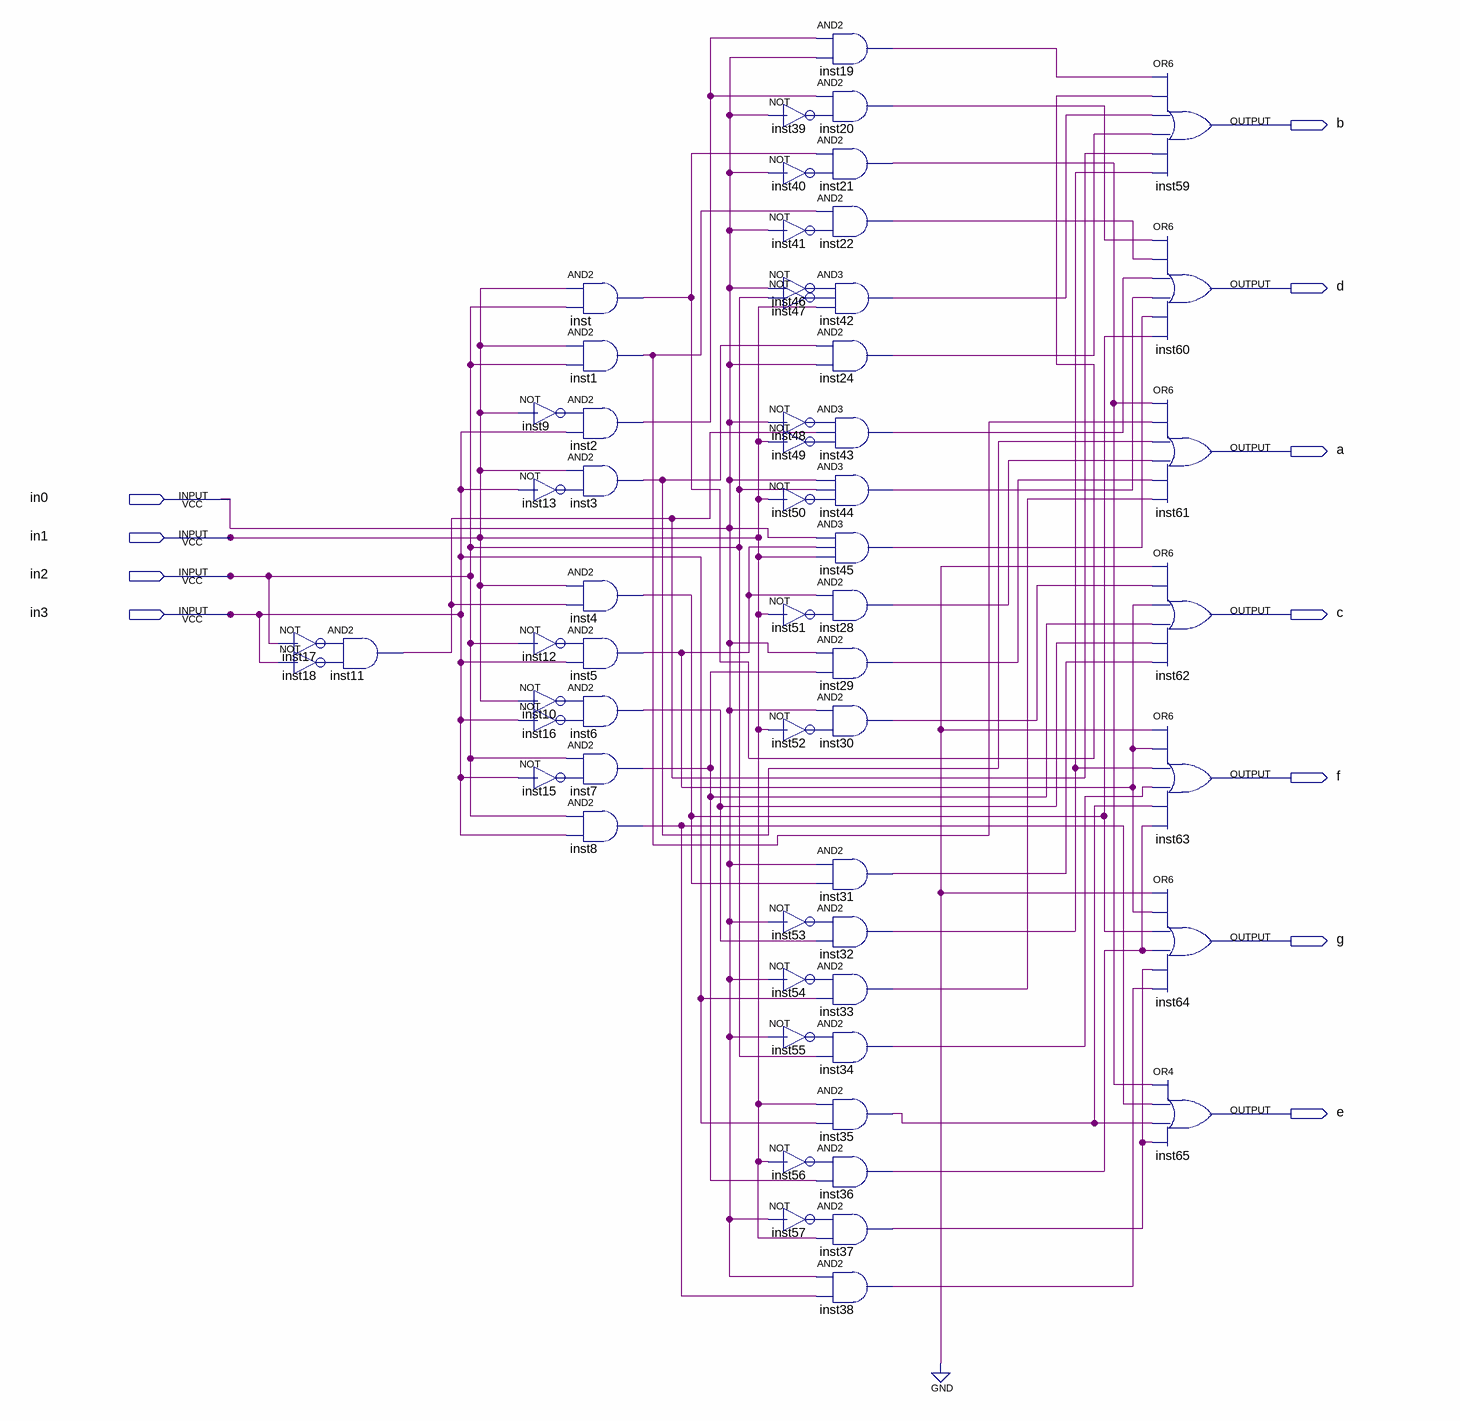
[diagram p0: schematic sheet]
// Quartus schematic Block1.bdf as structural Verilog: 60 symbols, 11 pins
module Block1 (
  input  in0,
  input  in1,
  input  in2,
  input  in3,
  output b,
  output d,
  output a,
  output c,
  output f,
  output g,
  output e
);

  wire inst1_out, inst2_out, inst3_out, inst4_out, inst5_out, inst6_out, inst7_out, inst8_out, inst9_out,
       inst10_out, inst11_out, inst12_out, inst13_out, inst15_out, inst16_out, inst17_out, inst18_out,
       inst19_out, inst20_out, inst21_out, inst22_out, inst24_out, inst28_out, inst29_out, inst30_out,
       inst31_out, inst32_out, inst33_out, inst34_out, inst35_out, inst36_out, inst37_out, inst38_out,
       inst39_out, inst40_out, inst41_out, inst42_out, inst43_out, inst44_out, inst45_out, inst46_out,
       inst47_out, inst48_out, inst49_out, inst50_out, inst51_out, inst52_out, inst53_out, inst54_out,
       inst55_out, inst56_out, inst57_out, inst_out;

  not inst17 (inst17_out, in2);
  not inst18 (inst18_out, in3);
  and inst11 (inst11_out, inst17_out, inst18_out);
  not inst9 (inst9_out, in1);
  not inst13 (inst13_out, in3);
  not inst12 (inst12_out, in2);
  not inst10 (inst10_out, in1);
  not inst16 (inst16_out, in3);
  not inst15 (inst15_out, in3);
  and inst (inst_out, in1, in2);
  and inst1 (inst1_out, in1, in2);
  and inst2 (inst2_out, inst9_out, in3);
  and inst3 (inst3_out, in1, inst13_out);
  and inst4 (inst4_out, in1, inst11_out);
  and inst5 (inst5_out, inst12_out, in3);
  and inst6 (inst6_out, inst10_out, inst16_out);
  and inst7 (inst7_out, in2, inst15_out);
  and inst8 (inst8_out, in2, in3);
  not inst39 (inst39_out, in0);
  not inst40 (inst40_out, in0);
  not inst41 (inst41_out, in0);
  not inst46 (inst46_out, in0);
  not inst47 (inst47_out, in2);
  not inst48 (inst48_out, in0);
  not inst49 (inst49_out, in1);
  not inst50 (inst50_out, in1);
  not inst51 (inst51_out, in1);
  not inst52 (inst52_out, in1);
  not inst53 (inst53_out, in0);
  not inst54 (inst54_out, in0);
  not inst55 (inst55_out, in0);
  not inst56 (inst56_out, in1);
  not inst57 (inst57_out, in0);
  and inst19 (inst19_out, inst2_out, in0);
  and inst20 (inst20_out, inst2_out, inst39_out);
  and inst21 (inst21_out, inst_out, inst40_out);
  and inst22 (inst22_out, inst1_out, inst41_out);
  and inst42 (inst42_out, inst46_out, inst47_out, in1);
  and inst24 (inst24_out, inst3_out, in0);
  and inst43 (inst43_out, inst48_out, inst11_out, inst49_out);
  and inst44 (inst44_out, in0, in2, inst50_out);
  and inst45 (inst45_out, in0, inst5_out, in1);
  and inst28 (inst28_out, inst5_out, inst51_out);
  and inst29 (inst29_out, in0, inst7_out);
  and inst30 (inst30_out, in0, inst52_out);
  and inst31 (inst31_out, in0, inst4_out);
  and inst32 (inst32_out, inst53_out, inst6_out);
  and inst33 (inst33_out, inst54_out, in3);
  and inst34 (inst34_out, inst55_out, in2);
  and inst35 (inst35_out, in1, in3);
  and inst36 (inst36_out, inst56_out, inst7_out);
  and inst37 (inst37_out, inst57_out, in1);
  and inst38 (inst38_out, in0, inst8_out);
  or inst59 (b, inst19_out, inst_out, inst42_out, inst24_out, inst11_out, inst32_out);
  or inst60 (d, inst20_out, inst22_out, inst43_out, inst44_out, inst45_out, inst4_out);
  or inst61 (a, inst21_out, inst1_out, inst3_out, inst28_out, inst29_out, inst33_out);
  or inst62 (c, 1'b0, inst30_out, inst5_out, inst7_out, inst6_out, inst31_out);
  or inst63 (f, 1'b0, inst5_out, inst32_out, inst34_out, inst35_out, inst36_out);
  or inst64 (g, 1'b0, inst5_out, inst4_out, inst36_out, inst37_out, inst38_out);
  or inst65 (e, inst21_out, inst8_out, inst35_out, inst37_out);
endmodule
